# EasyEDA Pro project ProPrj_BAP PCB Surgeon_2025-11-06.epro

# Schematic BAP PCB Surgeon
Board Name: BAP PCB std; Create Date: 2025-11-05; Page Name: Sheet_1; Project Name: BAP PCB Surgeon; Schematic Name: BAP PCB Surgeon; Update Date: 2025-11-05; Add into BOM: yes; Company: Your Company; Convert to PCB: yes; Date: 2025-10-31; Draw By: malkk44.mf; REV: 1.0; Sheet: 1/1; spicePre: .
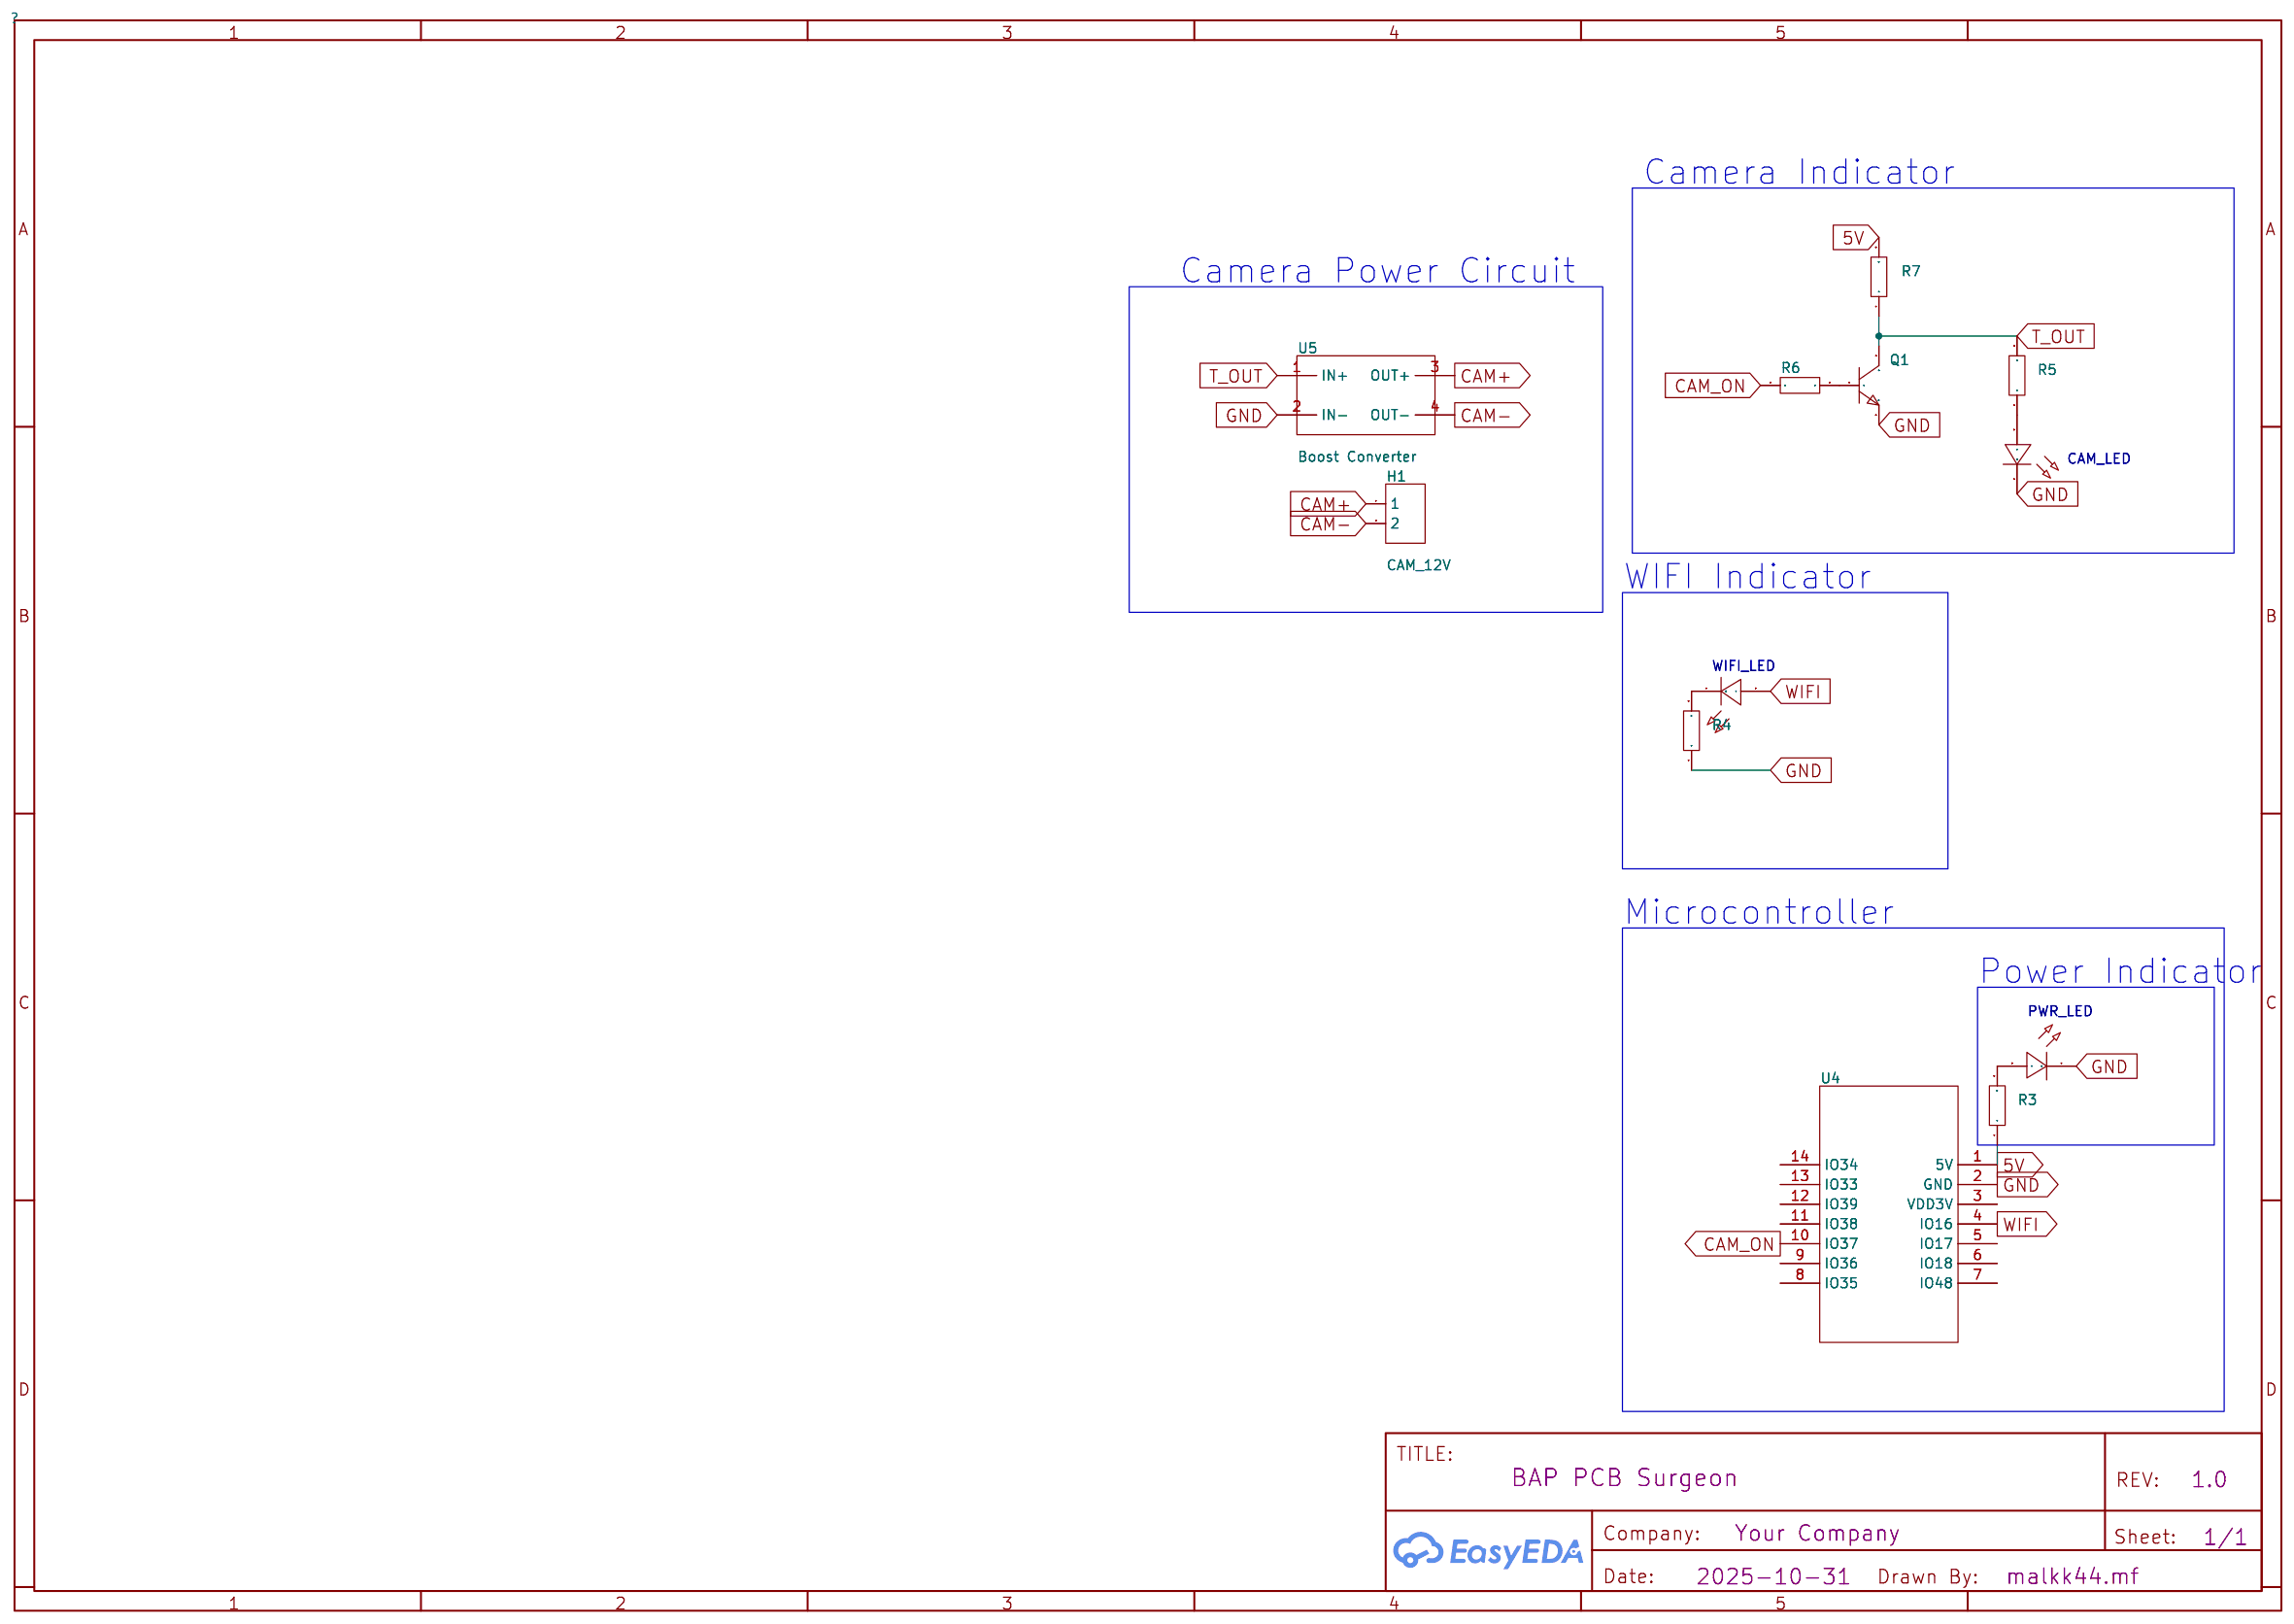
[diagram p0: schematic sheet]

## Parts
CAM_LED  -  [LED_0603]
H1  CAM_12V  [HDR-TH_2P-P2.54-V-F]
PWR_LED  -  [LED_0603]
Q1  -  [S8050_SOT-23]
R3  330Ω  [RES-TH_BD2.2-L6.5-P10.50-D0.6]
R4  330Ω  [RES-TH_BD2.2-L6.5-P10.50-D0.6]
R5  330Ω  [RES-TH_BD2.2-L6.5-P10.50-D0.6]
R6  -  [Resistor 1/8w 7mm metal film]
R7  -  [Resistor 1/8w 7mm metal film]
U4  -  [LilyGO TQ-T Pro]
U5  Boost Converter  [Boost Converter]
WIFI_LED  -  [LED_0603]

## Library data of the parts
CAM_LED PWR_LED WIFI_LED = LED_0603-G: Supplier Footprint: 0603
H1 = HDR-F_2.54_1x2P: Holes Structure:1x2P Pitch:2.54mm Row Spacing:- Mounting Type:Straight Number of Rows:Plugin Number of Holes:2P Insulation Height:- Contact Material:- Contact Plating:-; Supplier Part: C49661; Supplier Footprint: 插件; Holes Structure: 1x2P; Pitch: 2.54mm; Mounting Type: Straight; Number of Rows: Plugin; Number of Holes: 2P
Q1 = S8050_SOT_NPN: Supplier Footprint: SOT-23
R3-R5 = MFR-25FTE52-330R: Type:Metal Film Resistors Resistance: Tolerance:±1% Tolerance:±1% Power(Watts):250mW Temperature Coefficient:±50ppm/℃ Temperature Coefficient:±50ppm/℃; LCSC Part Name: 330Ω ±1% 250mW; Supplier Part: C138208; Manufacturer: YAGEO(国巨); Supplier Footprint: 轴向引线; JLCPCB Part Class: Extended Part; Datasheet: https://atta.szlcsc.com/upload/public/pdf/source/20171107/C138208_15100517551321097101.pdf; Supplier: LCSC; Type: Metal Film Resistors; Tolerance: ±1%; Power(Watts): 250mW; Temperature Coefficient: ±50ppm/℃
R6 R7 = resistor: Supplier: LCSC; Manufacturer: UNI-ROYAL(Uniroyal Elec); Manufacturer Part: 1206W4F1002T5E; Supplier Part: C17902; Resistance: 10KΩ; JLCPCB Part Class: Basic Part; Datasheet: https://datasheet.lcsc.com/lcsc/2206010145_UNI-ROYAL-Uniroyal-Elec-1206W4F1002T5E_C17902.pdf
U4 = LilyGO TQ-T Pro
U5 = Boost Converter

## Nets
5V: R3.1 R7.2 U4.1(5V)
GND: CAM_LED.1(C) PWR_LED.1(C) Q1.2 R4.1 U4.2(GND) U5.2(IN-)
CAM+: H1.1 U5.3(OUT+)
CAM-: H1.2 U5.4(OUT-)
CAM_ON: R6.1 U4.10(IO37)
T_OUT: Q1.3 R5.2 R7.1 U5.1(IN+)
WIFI: U4.4(IO16) WIFI_LED.2(A)
$1N1519: PWR_LED.2(A) R3.2
$1N2330: R4.2 WIFI_LED.1(C)
$1N2503: CAM_LED.2(A) R5.1
$1N3445: Q1.1 R6.2

Not connected (* = marked no-connect by the designer): U4 3(VDD3V) 5(IO17) 6(IO18) 7(IO48) 8(IO35) 9(IO36) 11(IO38) 12(IO39) 13(IO33) 14(IO34)

## Notes on the sheet
- Camera Indicator
- Camera Power Circuit
- WIFI Indicator
- Microcontroller
- Power Indicator

# Board PCB2
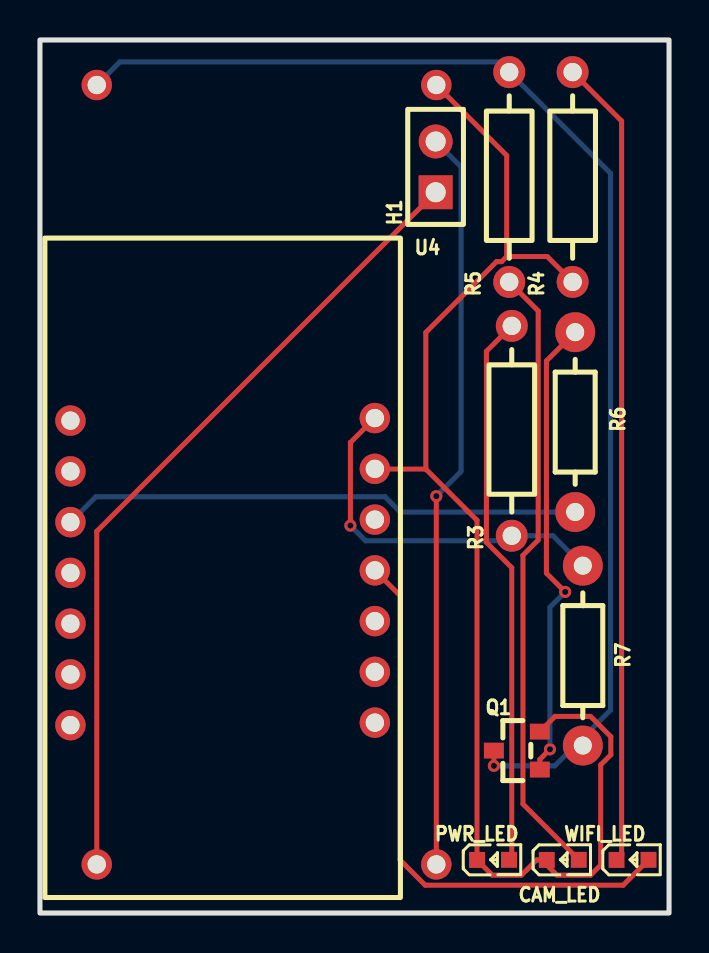
[diagram p1: board, top side]
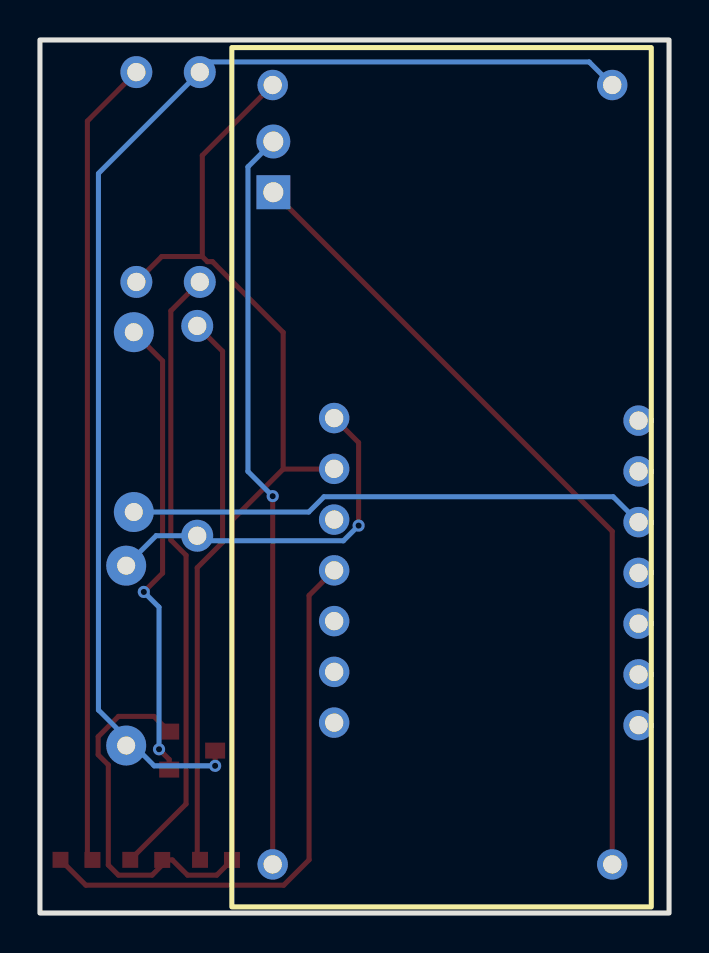
[diagram p2: board, bottom side, seen from below]

Outline 31.5 x 43.69 mm; copper layers: Top Layer, Bottom Layer. Coordinates in mm from the lower left corner of the outline.
Outline path: rectangle 0,43.69 31.5,0
Stack: Top Layer 0.035mm / Dielectric1 1.51mm FR4 er 4.5 / Bottom Layer 0.035mm

## Design rules (mm)
template: JLCPCB Capability(Two Layers Board)
spacing copperThickness1oz (default): track to track 0.102, other pairs 0.152 to 0.3
spacing copperThickness2oz: track to track 0.203, other pairs 0.152 to 0.3
track width copperThickness1oz (default): min 0.127, default 0.254, max 2.54
track width copperThickness2oz: min 0.203, default 0.254, max 2.54
differential pair differentialPair (default): width min 0.127, default 0.254, max 2.54; gap min 0.152, default 0.152
via viaSize (default): diameter min 0.5, default 0.61, max 10; hole min 0.3, default 0.305, max 6.3

## Placement (name value [footprint] x y rotation side)
CAM_LED  -  [LED_0603]  26.23 2.67 0 top
H1  CAM_12V  [HDR-TH_2P-P2.54-V-F]  19.81 37.34 90 top
PWR_LED  -  [LED_0603]  22.73 2.67 0 top
Q1  -  [S8050_SOT-23]  23.88 8 0 top
R3  330Ω  [RES-TH_BD2.2-L6.5-P10.50-D0.6]  23.62 24.13 90 top
R4  330Ω  [RES-TH_BD2.2-L6.5-P10.50-D0.6]  26.67 36.83 90 top
R5  330Ω  [RES-TH_BD2.2-L6.5-P10.50-D0.6]  23.5 36.83 90 top
R6  -  [Resistor 1/8w 7mm metal film]  26.8 20.07 90 top
R7  -  [Resistor 1/8w 7mm metal film]  27.18 8.38 90 top
U4  -  [LilyGO TQ-T Pro]  9.15 17.27 0 top
U5  -  [Boost Converter]  21.84 43.43 270 bottom
WIFI_LED  -  [LED_0603]  29.72 2.67 0 top

## Footprints (pads in the part's own frame, mm; a bottom-side part is the same pattern mirrored in y, then rotated)
Boost Converter
  round 1.524 hole 0.914: 1(2,19) 2(2,2) 3(41,19) 4(41,2)
HDR-TH_2P-P2.54-V-F
  rect 1.7x1.7 hole 1: 1(-1.27,0)
  round 1.7 hole 1: 2(1.27,0)
LED_0603
  rect 0.8x0.8 smd: 1(-0.851,-0.01) 2(0.75,-0.005)
LilyGO TQ-T Pro
  round 1.524 hole 0.914: 1(7.62,7.493) 2(7.62,4.953) 3(7.62,2.413) 4(7.62,-0.127) 5(7.62,-2.667) 6(7.62,-5.207) 7(7.62,-7.747) 8(-7.62,7.366) 9(-7.62,4.826) 10(-7.62,2.286) 11(-7.62,-0.254) 12(-7.62,-2.794) 13(-7.62,-5.334) 14(-7.62,-7.874)
RES-TH_BD2.2-L6.5-P10.50-D0.6
  round 1.6 hole 0.914: 1(-5.25,0) 2(5.25,0)
Resistor 1/8w 7mm metal film
  round 2 hole 0.9: 1(0,0) 2(9,0)
S8050_SOT-23
  rect 1x0.8 smd: 1(1.15,-0.823) 2(1.15,1.077) 3(-1.15,0.127)

## Nets
As in the schematic.

Pads without a net: U4 3 5 6 7 8 9 11 12 13 14

## Via types
v1: diameter 0.61, hole 0.305, Top Layer to Bottom Layer, 5 vias

## Routing (per net, layer and track width the routed paths; a pad name or vN(x,y) marks a point on that pad's centre or on a via; arc(x,y) is an arc through that point)
5V: length 18.6
  Top Layer w0.254: v1(15.54,19.39) 15.54,23.54 U4.1
  Bottom Layer w0.254: R7.2 25.68,18.88 R3.1 23.37,18.63 16.3,18.63 v1(15.54,19.39)
GND: length 68
  Top Layer w0.254: R4.1 25.4,32.85 23.37,32.85 ; 23.37,32.85 23.11,32.6 22.86,32.6 19.32,29.05 19.32,22.22 ; 23.37,32.85 23.37,37.91 U5.2 ; 19.32,22.22 21.88,19.65 PWR_LED.1 22.64,1.89 24.1,1.89 24.87,2.66 25.12,2.66 ; 19.32,22.22 16.78,22.22 U4.2 ; Q1.2 25.79,9.84 27.57,9.84 28.58,8.82 28.58,7.92 28.07,7.41 28.07,2.4 27.57,1.89 25.88,1.89 25.12,2.66 ; CAM_LED.1 25.12,2.66
CAM+: length 40.7
  Top Layer w0.254: U5.3 2.84,19.1 H1.1
CAM-: length 37.2
  Top Layer w0.254: v1(19.84,20.86) U5.4
  Bottom Layer w0.254: H1.2 21.08,37.34 21.08,22.1 v1(19.84,20.86)
CAM_ON: length 26.1
  Bottom Layer w0.254: U4.10 2.8,20.83 17.27,20.83 18.04,20.07 R6.1
T_OUT: length 63.5
  Top Layer w0.254: Q1.3 v1(22.73,7.37)
  Bottom Layer w0.254: v1(22.73,7.37) 25.77,7.37 26.79,8.38 ; 26.79,8.38 28.57,10.16 28.57,37.01 R5.2 22.99,42.59 4,42.59 U5.1 ; 26.79,8.38 R7.1
WIFI: length 28.5
  Top Layer w0.254: U4.4 18.02,15.89 18.02,2.66 19.29,1.39 29.2,1.39 WIFI_LED.2
$1N1519: length 27.8
  Top Layer w0.254: PWR_LED.2 23.62,2.8 23.62,17.28 22.35,18.55 22.35,28.11 R3.2
$1N2330: length 40.5
  Top Layer w0.254: WIFI_LED.1 29.12,2.91 29.12,39.63 R4.2
$1N2503: length 31
  Top Layer w0.254: R5.1 24.94,30.13 24.94,18.66 24.18,17.9 24.18,5.46 CAM_LED.2
$1N3445: length 23.4
  Top Layer w0.254: R6.2 25.36,27.62 25.36,17.01 v1(26.3,16.07) ; v1(25.53,8.19) 25.03,7.69 Q1.1
  Bottom Layer w0.254: v1(26.3,16.07) 25.53,15.31 v1(25.53,8.19)
